# Altium project MSXII_DriverControlsCarrierBoard.PrjPcb
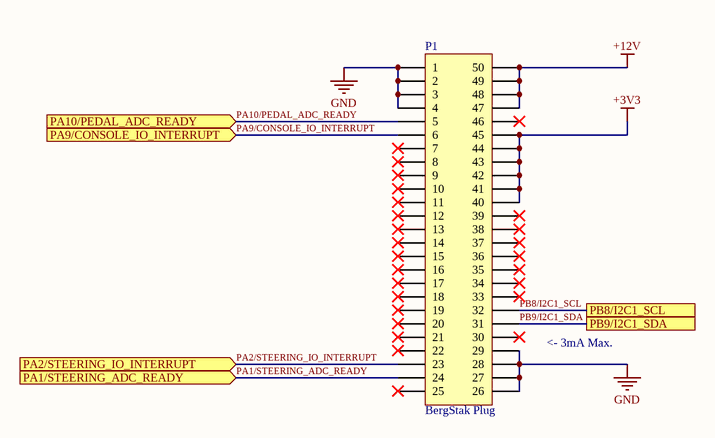
[diagram p0: DriverControlsCarrierBoardMezzanine.SchDoc]
ProjectAuthor: Mena Labib; ProjectRevision: 2.1
2 sheets, 12 parts. Net scope: flat (ports and power ports of the same name join across sheets).
Board file: DriverControlsCarrierboard.PcbDoc
Sheets:
  DriverControlsCarrierBoardMezzanine.SchDoc
  DriverControlsCarrierboard.SchDoc

## Sheet DriverControlsCarrierBoardMezzanine.SchDoc: Controller Board Interface
size Letter; Organization: Midnight Sun Solar Rayce Car Team; Address1: University of Waterloo; Address2: 200 University Ave W; Address3: Waterloo, ON, Canada; Address4: N2L 3E9; SheetNumber: 1; SheetTotal: 2; Website: www.uwmidsun.com

### Parts
P1  Series: BergStak Plug  [CONN, Bergstak 50 Pos Plug]  (hidden comment: CONN 50POS Bergstak Plug 0.02")

### Ports
PA1/STEERING_ADC_READY (in), PA2/STEERING_IO_INTERRUPT (in), PA9/CONSOLE_IO_INTERRUPT (in), PA10/PEDAL_ADC_READY (in), PB8/I2C1_SCL, PB9/I2C1_SDA

### Nets
+3V3: P1.40 P1.41 P1.42 P1.43 P1.44 P1.45
+12V: P1.47 P1.48 P1.49 P1.50
GND: P1.1 P1.2 P1.3 P1.4 P1.26 P1.27 P1.28 P1.29
PA1/STEERING_ADC_READY: P1.24 ; port PA1/STEERING_ADC_READY
PA2/STEERING_IO_INTERRUPT: P1.23 ; port PA2/STEERING_IO_INTERRUPT
PA9/CONSOLE_IO_INTERRUPT: P1.6 ; port PA9/CONSOLE_IO_INTERRUPT
PA10/PEDAL_ADC_READY: P1.5 ; port PA10/PEDAL_ADC_READY
PB8/I2C1_SCL: P1.32 ; port PB8/I2C1_SCL
PB9/I2C1_SDA: P1.31 ; port PB9/I2C1_SDA

Not connected (* = marked no-connect by the designer): P1 7* 8* 9* 10* 11* 12* 13* 14* 15* 16* 17* 18* 19* 20* 21* 22* 25* 30* 33* 34* 35* 36* 37* 38* 39* 46*

### Notes on the sheet
- <- 3mA Max.
- Project:
- Title:
- Size:
- Project Author
- Letter
- Revision:
- University of Waterloo
- 200 University Ave W
- Waterloo, ON, Canada
- N2L 3E9
- Date:
- Sheet
- of
- Website:

### Library data of the parts
P1 = CONN 50POS Bergstak Plug 0.02": 50 Position Connector Plug, Outer Shroud Contacts Surface Mount Gold; Manufacturer 1: Amphenol FCI; Manufacturer Part Number 1: 10132797-055100LF; Number of Positions: 50; Mated Stacking Heights: 5mm; Pitch: 0.020" (0.50mm); Supplier 1: Digi-Key; Supplier Part Number 1: 609-5226-1-ND; Packaging: Cut Tape (CT); Part Status: Active; Connector Type: Plug, Outer Shroud Contacts; Number of Rows: 2; Mounting Type: Surface Mount; Contact Finish: Gold; Contact Finish Thickness: 1µin (0.025µm); Height Above Board: 0.169" (4.30mm); ComponentLink1URL: http://portal.fciconnect.com/Comergent//fci/drawing/10132797.pdf; ComponentLink1Description: http://portal.fciconnect.com/Comergent//fci/drawing/10132797.pdf

## Sheet DriverControlsCarrierboard.SchDoc: Driver Controls Carrier
size Letter; Organization: Midnight Sun Solar Rayce Car Team; Address1: University of Waterloo; Address2: 200 University Ave W; Address3: Waterloo, ON, Canada; Address4: N2L 3E9; SheetNumber: 2; SheetTotal: 2; Website: www.uwmidsun.com
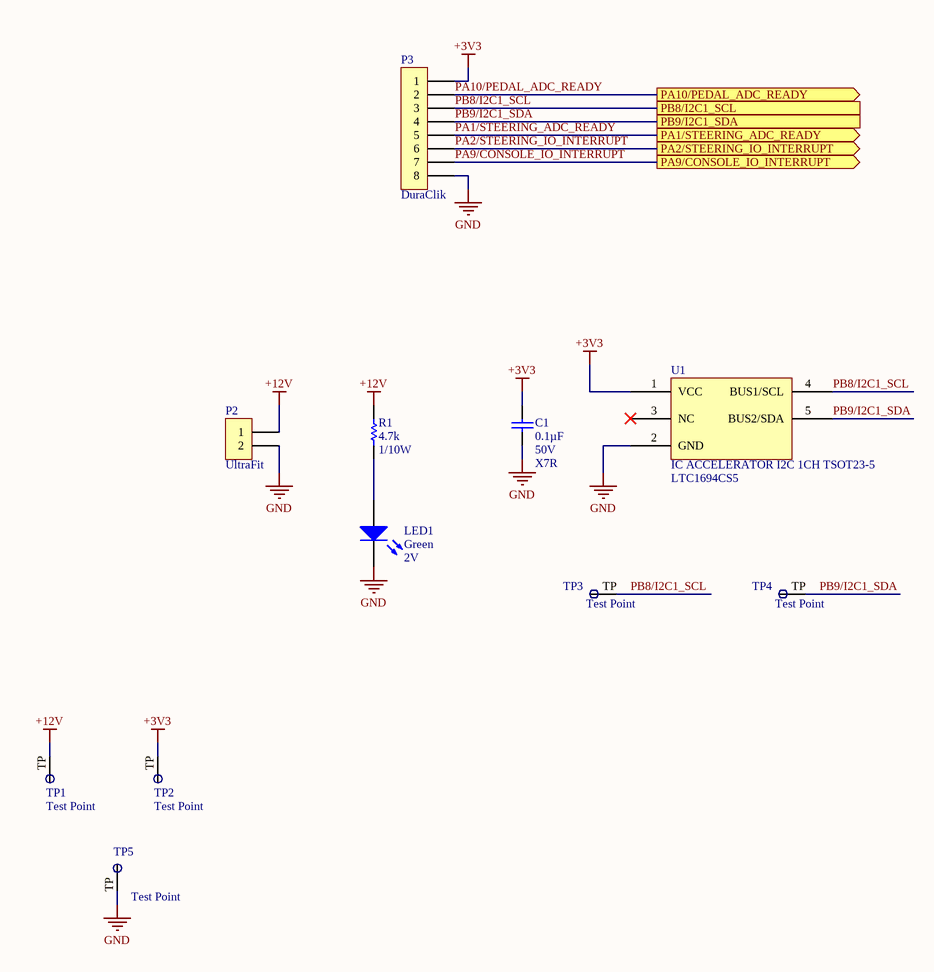
[diagram p1: DriverControlsCarrierboard.SchDoc]

### Parts
C1  Capacitance: 0.1µF  Voltage: 50V  Temperature Coefficient: X7R  [CAP, 0603]  (hidden comment: CAP CER 0.1UF 50V 10% X7R 0603)
LED1  Color: Green  Voltage - Forward (Vf) (Typ): 2V  [LED_0603]  (hidden comment: LED GREEN CLEAR 2V 0603)
P2  Series: UltraFit  [CONN, 2POS ULTRA-FIT]  (hidden comment: CONN 2POS ULTRA-FIT 0.138")
P3  Series: DuraClik  [CONN, 8POS Dura-Clik]  (hidden comment: CONN 8POS DURA-CLIK 0.079")
R1  Resistance (Ohms): 4.7k  Power (Watts): 1/10W  [RES, 0603]  (hidden comment: RES 4.7K OHM 1% 1/10W 0603)
TP1  Test Point  [Test Point]
TP2  Test Point  [Test Point]
TP3  Test Point  [Test Point]
TP4  Test Point  [Test Point]
TP5  Test Point  [Test Point]
U1  IC ACCELERATOR I2C 1CH TSOT23-5  Supplier Part Number: LTC1694CS5  [IC OP AMP GP RR 10MHZ SOT-23-5]

### Ports
PA1/STEERING_ADC_READY (out), PA2/STEERING_IO_INTERRUPT (out), PA9/CONSOLE_IO_INTERRUPT (out), PA10/PEDAL_ADC_READY (out), PB8/I2C1_SCL, PB9/I2C1_SDA

### Nets
+3V3: C1.1 P3.1 TP2.TP U1.1(VCC)
+12V: P2.1 R1.1 TP1.TP
GND: C1.2 LED1.2(K) P2.2 P3.8 TP5.TP U1.2(GND)
PA1/STEERING_ADC_READY: P3.5 ; port PA1/STEERING_ADC_READY
PA2/STEERING_IO_INTERRUPT: P3.6 ; port PA2/STEERING_IO_INTERRUPT
PA9/CONSOLE_IO_INTERRUPT: P3.7 ; port PA9/CONSOLE_IO_INTERRUPT
PA10/PEDAL_ADC_READY: P3.2 ; port PA10/PEDAL_ADC_READY
PB8/I2C1_SCL: P3.3 TP3.TP U1.4(BUS1/SCL) ; port PB8/I2C1_SCL
PB9/I2C1_SDA: P3.4 TP4.TP U1.5(BUS2/SDA) ; port PB9/I2C1_SDA
NetLED1_1: LED1.1(A) R1.2

Not connected (* = marked no-connect by the designer): U1 3(NC)*

### Notes on the sheet
- Project:
- Title:
- Size:
- Project Author
- Letter
- Revision:
- University of Waterloo
- 200 University Ave W
- Waterloo, ON, Canada
- N2L 3E9
- Date:
- Sheet
- of
- Website:

### Library data of the parts
C1 = CAP CER 0.1UF 50V 10% X7R 0603: 0.10µF ±10% 50V Ceramic Capacitor X7R 0603 (1608 Metric); Manufacturer 1: AVX Corporation; Manufacturer Part Number 1: 06035C104KAT2A; Supplier 1: Digi-Key; Supplier Part Number 1: 478-5052-1-ND; Packaging: Cut Tape (CT); Part Status: Active; Operating Temperature: -55°C ~ 125°C; Ratings: -; Mounting Type: Surface Mount, MLCC; Package / Case: 0603 (1608 Metric); Size / Dimension: 0.063" L x 0.032" W (1.60mm x 0.81mm); Height - Seated (Max): -; Thickness (Max): 0.035" (0.90mm); Lead Spacing: -; Lead Style: -; ComponentLink1URL: http://datasheets.avx.com/X7RDielectric.pdf; ComponentLink1Description: http://datasheets.avx.com/X7RDielectric.pdf; Tolerance: ±10%
LED1 = LED GREEN CLEAR 2V 0603: Green 572nm LED Indication - Discrete 2V 0603 (1608 Metric); Manufacturer: Wurth Electronics Inc.; Manufacturer Part Number: 150060VS75000; Lens Color: Colorless; Millicandela Rating: 40mcd; Lens Style/Size: Rectangle with Flat Top, 1.10mm x 0.70mm; Current - Test: 20mA; Viewing Angle: 140°; Wavelength - Dominant: 570nm; Supplier 1: Digi-Key; RoHS: RoHS Compliant; Category: Optoelectronics; Stock 1: 9408; Pricing 1: 1=0.21, 100=0.1617, 500=0.13964 (CAD); Packaging: Cut Tape (CT); Part Status: Active; Lens Transparency: Clear; Mounting Type: Surface Mount; Wavelength - Peak: 572nm; Features: -; Package / Case: 0603 (1608 Metric); Supplier Device Package: 0603; Size / Dimension: 1.60mm L x 0.80mm W; Height (Max): 0.80mm; ComponentLink1URL: http://katalog.we-online.de/led/datasheet/150060VS75000.pdf; ComponentLink1Description: http://katalog.we-online.de/led/datasheet/150060VS75000.pdf; Supplier Part Number 1: 732-4980-1-ND
P2 = CONN 2POS ULTRA-FIT 0.138": 2 Positions Header, Shrouded Connector 0.138" (3.50mm) Through Hole Gold; Manufacturer 1: Molex, LLC; Manufacturer Part Number 1: 1722861302; Style: Board to Board or Cable; Shrouding: Shrouded - 4 Wall; Number of Positions: 2; Number of Positions Loaded: All; Contact Length - Post: 0.126" (3.20mm); Material Flammability Rating: UL94 V-0; Mated Stacking Heights: 26.99mm; Voltage: 400V; Supplier 1: Digi-Key; Supplier Part Number 1: WM11673-ND; Packaging: Tray; Part Status: Active; Connector Type: Header; Contact Type: Male Pin; Pitch - Mating: 0.138" (3.50mm); Number of Rows: 1; Row Spacing - Mating: -; Mounting Type: Through Hole; Termination: Kinked Pin, Solder; Fastening Type: Latch Holder; Contact Length - Mating: -; Overall Contact Length: -; Insulation Height: 0.465" (11.80mm); Contact Shape: Square; Contact Finish - Mating: Gold; Contact Finish Thickness - Mating: 30µin (0.76µm); Contact Finish - Post: Tin; Contact Material: Copper Alloy; Insulation Material: Liquid Crystal Polymer (LCP); Operating Temperature: -40°C ~ 120°C; Ingress Protection: -; Insulation Color: Black; Current Rating: -; Contact Finish Thickness - Post: 60µin (1.52µm); ComponentLink1URL: http://www.molex.com/pdm_docs/sd/1722861302_sd.pdf; ComponentLink1Description: http://www.molex.com/pdm_docs/sd/1722861302_sd.pdf
P3 = CONN 8POS DURA-CLIK 0.079": 8 Positions Header Connector 0.079" (2.00mm) Surface Mount Tin; Manufacturer 1: Molex, LLC; Manufacturer Part Number 1: 5600200820; Style: Board to Cable/Wire; Shrouding: Shrouded - 4 Wall; Number of Positions: 8; Number of Positions Loaded: All; Mated Stacking Heights: 9.3mm; Supplier 1: Digi-Key; Supplier Part Number 1: WM10868CT-ND; Packaging: Cut Tape (CT); Part Status: Active; Connector Type: Header; Contact Type: Male Pin; Pitch - Mating: 0.079" (2.00mm); Number of Rows: 1; Row Spacing - Mating: -; Mounting Type: Surface Mount; Termination: Solder; Fastening Type: Latch Lock; Contact Length - Mating: -; Contact Length - Post: -; Overall Contact Length: -; Insulation Height: 0.315" (8.00mm); Contact Shape: Square; Contact Finish - Mating: Tin; Contact Finish Thickness - Mating: -; Contact Finish - Post: Tin; Contact Material: Copper Alloy; Insulation Material: Polyamide (PA), Nylon; Operating Temperature: -; Ingress Protection: -; Material Flammability Rating: -; Insulation Color: Natural; Current Rating: -; Contact Finish Thickness - Post: -; ComponentLink1URL: http://www.molex.com/pdm_docs/sd/5600200820_sd.pdf; ComponentLink1Description: http://www.molex.com/pdm_docs/sd/5600200820_sd.pdf; Voltage: -
R1 = RES 4.7K OHM 1% 1/10W 0603: 4.7k Ohm ±1% 0.1W, 1/10W Chip Resistor 0603 (1608 Metric) Moisture Resistant Thick Film; Manufacturer 1: Yageo; Manufacturer Part Number 1: RC0603FR-074K7L; Description 1: RES SMD 4.7K OHM 1% 1/10W 0603; Temperature Coefficient: ±100ppm/°C; Supplier 1: Digi-Key; Supplier Part Number 1: 311-4.70KHRCT-ND; RoHS: RoHS Compliant; Category: Resistors; Stock 1: 3487566; Pricing 1: 1=0.16, 10=0.022, 100=0.0089, 1000=0.00402, 2500=0.00349 (CAD); Packaging: Cut Tape (CT); Part Status: Active; Composition: Thick Film; Features: Moisture Resistant; Operating Temperature: -55°C ~ 155°C; Package / Case: 0603 (1608 Metric); Supplier Device Package: 0603; Size / Dimension: 0.063" L x 0.031" W (1.60mm x 0.80mm); Height - Seated (Max): 0.022" (0.55mm); Failure Rate: -; ComponentLink1URL: http://www.yageo.com/documents/recent/PYu-RC_Group_51_RoHS_L_7.pdf; ComponentLink1Description: http://www.yageo.com/documents/recent/PYu-RC_Group_51_RoHS_L_7.pdf; Tolerance: ±1%
U1 = IC ACCELERATOR I2C 1CH TSOT23-5: Accelerator 1 Channel 400kHz TSOT-23-5; Manufacturer: Linear Technology/Analog Devices; Manufacturer Part Number: LTC1694CS5#TRMPBF; Input: 2-Wire Bus; Number of Channels: 1; Voltage - Supply: 2.7 V ~ 6 V; Current - Supply: 60µA; Supplier 1: Digi-Key; RoHS: RoHS Compliant; Category: Integrated Circuits (ICs); Pricing 1: 1=4.79, 25=4.278, 100=2.5493, 250=2.33692 (CAD); Packaging: Cut Tape (CT); Part Status: Active; Type: Accelerator; Applications: I²C; Output: 2-Wire Bus; Data Rate (Max): 400kHz; Delay Time: -; Signal Conditioning: -; Operating Temperature: 0°C ~ 70°C; Package / Case: SOT-23-5 Thin, TSOT-23-5; Supplier Device Package: TSOT-23-5; Base Part Number: LTC1694; ComponentLink1URL: http://www.linear.com/docs/3505; ComponentLink1Description: http://www.linear.com/docs/3505; Supplier Part Number 1: LTC1694CS5#TRMPBFCT-ND; Stock 1: 794

## Nets that join several sheets
+3V3: DriverControlsCarrierBoardMezzanine (6 pins), DriverControlsCarrierboard (C1.1 P3.1 TP2.TP U1.1)
+12V: DriverControlsCarrierBoardMezzanine (P1.47 P1.48 P1.49 P1.50), DriverControlsCarrierboard (P2.1 R1.1 TP1.TP)
GND: DriverControlsCarrierBoardMezzanine (8 pins), DriverControlsCarrierboard (6 pins)
PA1/STEERING_ADC_READY: DriverControlsCarrierBoardMezzanine (P1.24), DriverControlsCarrierboard (P3.5)
PA2/STEERING_IO_INTERRUPT: DriverControlsCarrierBoardMezzanine (P1.23), DriverControlsCarrierboard (P3.6)
PA9/CONSOLE_IO_INTERRUPT: DriverControlsCarrierBoardMezzanine (P1.6), DriverControlsCarrierboard (P3.7)
PA10/PEDAL_ADC_READY: DriverControlsCarrierBoardMezzanine (P1.5), DriverControlsCarrierboard (P3.2)
PB8/I2C1_SCL: DriverControlsCarrierBoardMezzanine (P1.32), DriverControlsCarrierboard (P3.3 TP3.TP U1.4)
PB9/I2C1_SDA: DriverControlsCarrierBoardMezzanine (P1.31), DriverControlsCarrierboard (P3.4 TP4.TP U1.5)